# EAGLE design GameboyCartridgeKS_Ultima (EAGLE 9.5.2)
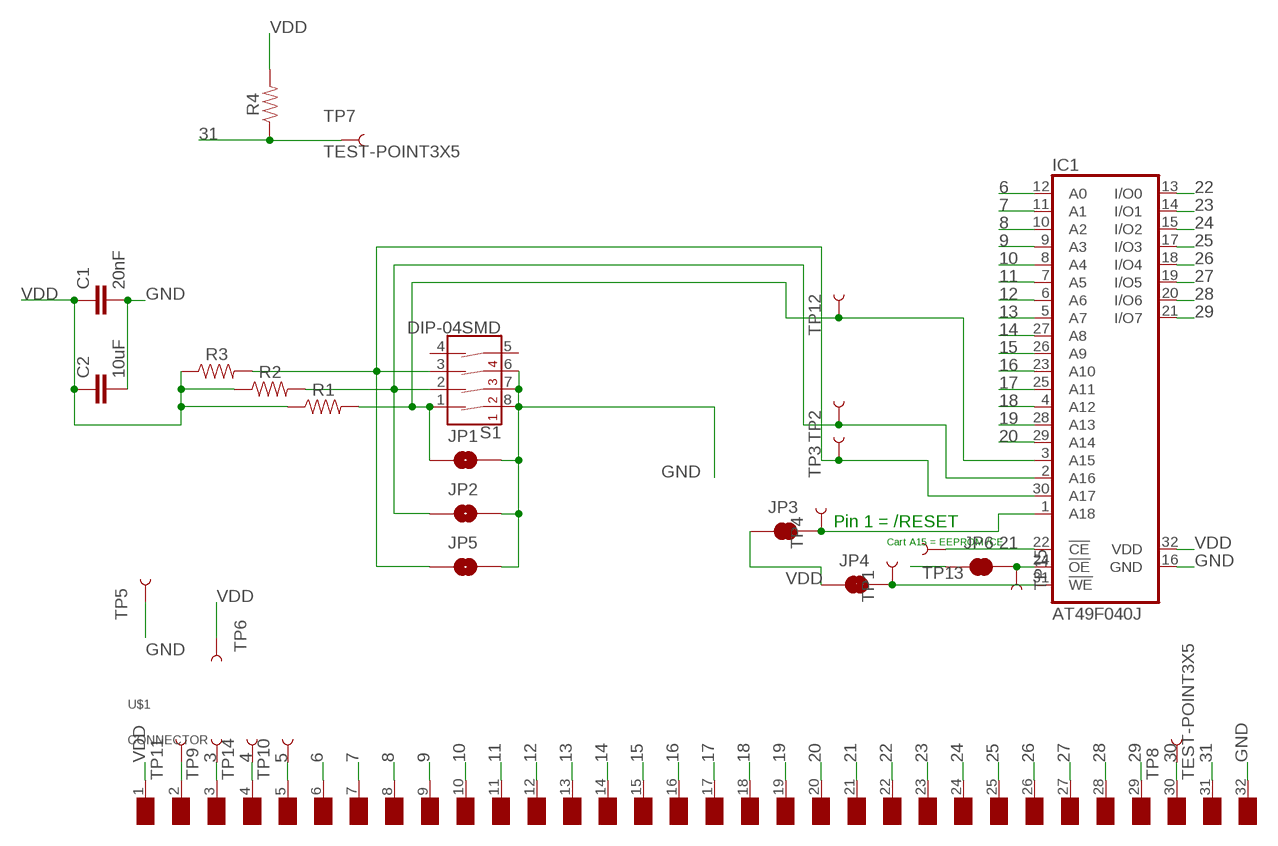
[diagram p0: schematic, sheet 1]

## Parts
C1  20nF  C-EUC0805  [C0805]
C2  10uF  10UF-1206-6.3V-20%  [1206]
IC1  AT49F040J  [PLCC32R]
JP1  JUMPER-SMT_2_NO_NO-SILK  [SMT-JUMPER_2_NO_NO-SILK]
JP2  JUMPER-SMT_2_NO_NO-SILK  [SMT-JUMPER_2_NO_NO-SILK]
JP3  JUMPER-SMT_2_NC_TRACE_SILK  [SMT-JUMPER_2_NC_TRACE_SILK]
JP4  JUMPER-SMT_2_NC_TRACE_SILK  [SMT-JUMPER_2_NC_TRACE_SILK]
JP5  JUMPER-SMT_2_NO_NO-SILK  [SMT-JUMPER_2_NO_NO-SILK]
JP6  JUMPER-SMT_2_NC_TRACE_SILK  [SMT-JUMPER_2_NC_TRACE_SILK]
R1  RESISTOR1206  [1206]
R2  RESISTOR1206  [1206]
R3  RESISTOR1206  [1206]
R4  RESISTOR1206  [1206]
S1  DIP-04SMD  [DIPSWITCH-04-SMD]
TP1  TEST-POINT3X5  [PAD.03X.05]
TP2  TEST-POINT3X5  [PAD.03X.05]
TP3  TEST-POINT3X5  [PAD.03X.05]
TP4  TEST-POINT3X5  [PAD.03X.05]
TP5  TEST-POINT3X5  [PAD.03X.05]
TP6  TEST-POINT3X5  [PAD.03X.05]
TP7  TEST-POINT3X5  [PAD.03X.05]
TP8  TEST-POINT3X5  [PAD.03X.05]
TP9  TEST-POINT3X5  [PAD.03X.05]
TP10  TEST-POINT3X5  [PAD.03X.05]
TP11  TEST-POINT3X5  [PAD.03X.05]
TP12  TEST-POINT3X5  [PAD.03X.05]
TP13  TEST-POINT3X5  [PAD.03X.05]
TP14  TEST-POINT3X5  [PAD.03X.05]
TP15  TEST-POINT3X5  [PAD.03X.05]
U$1  CONNECTOR  [CONNECTOR]

## Nets
3: TP9.P$1 U$1.3(/WR)
4: JP6.1 TP14.P$1 U$1.4(/RD)
5: TP10.P$1 U$1.5(/RCS)
6: IC1.12(A0) U$1.6(A0)
7: IC1.11(A1) U$1.7(A1)
8: IC1.10(A2) U$1.8(A2)
9: IC1.9(A3) U$1.9(A3)
10: IC1.8(A4) U$1.10(A4)
11: IC1.7(A5) U$1.11(A5)
12: IC1.6(A6) U$1.12(A6)
13: IC1.5(A7) U$1.13(A7)
14: IC1.27(A8) U$1.14(A8)
15: IC1.26(A9) U$1.15(A9)
16: IC1.23(A10) U$1.16(A10)
17: IC1.25(A11) U$1.17(A11)
18: IC1.4(A12) U$1.18(A12)
19: IC1.28(A13) U$1.19(A13)
20: IC1.29(A14) U$1.20(A14)
21: IC1.22(!CE) TP13.P$1 U$1.21(A15)
22: IC1.13(I/O0) U$1.22(D0)
23: IC1.14(I/O1) U$1.23(D1)
24: IC1.15(I/O2) U$1.24(D2)
25: IC1.17(I/O3) U$1.25(D3)
26: IC1.18(I/O4) U$1.26(D4)
27: IC1.19(I/O5) U$1.27(D5)
28: IC1.20(I/O6) U$1.28(D6)
29: IC1.21(I/O7) U$1.29(D7)
30: TP8.P$1 U$1.30(/RS)
31: R4.1 TP7.P$1 U$1.31(VIN)
GND: C1.2 C2.2 IC1.16(GND) JP1.2 JP2.2 JP5.2 S1.6(3B) S1.7(2B) S1.8(1B) TP5.P$1 U$1.32(GND)
N$1: IC1.31(!WE) JP4.2 TP1.P$1
N$2: TP11.P$1 U$1.2(NC)
N$3: IC1.24(!OE) JP6.2 TP15.P$1
N$4: IC1.3(A15) JP1.1 R1.2 S1.1(1A) TP12.P$1
N$7: IC1.1(A18) JP3.2 TP4.P$1
N$8: IC1.2(A16) JP2.1 R2.2 S1.2(2A) TP2.P$1
N$9: IC1.30(A17) JP5.1 R3.2 S1.3(3A) TP3.P$1
VDD: C1.1 C2.1 IC1.32(VDD) JP3.1 JP4.1 R1.1 R2.1 R3.1 R4.2 TP6.P$1 U$1.1(VDD)
Unconnected: S1.4(4A) S1.5(4B)

## Notes on the sheet
- Pin 1 = /RESET
- Cart A15 = EEPROM /CE

## Library data of the parts
C1 = resistor:C-EU: CAPACITOR, European symbol
C2 = SparkFun-Capacitors:10UF: 10.0µF ceramic capacitors A capacitor is a passive two-terminal electrical component used to store electrical energy temporarily in an electric field.; PROD_ID: CAP-10057
IC1 = gameboy:AT49F040J: 4-Megabit FLASH MEMORY (512 K x 8 bit) 5 V-only
JP1 JP2 JP5 = SparkFun-Jumpers:JUMPER-SMT_2_NO: Normally open jumper This jumper has two pads in close proximity to each other. Apply solder to close the connection. Round pads are easier to solder for beginners, but are a lot larger. SparkFun Product that uses the round pads: SparkFun EL Sequencer <https://www.sparkfun.com/products/12781>
JP3 JP4 JP6 = SparkFun-Jumpers:JUMPER-SMT_2_NC_TRACE: Normally closed trace jumper This jumper has a trace between two pads so it's normally closed (NC). Use a razor knife to open the connection. For best results follow the IPC guidelines for cutting traces: Cutout at least 0.063 mm (0.005 in). Remove all loose material to clean up the cut area. Seal the cut with an approved epoxy. Reapply solder to reclose the connection.
R1-R4 = SparkFun-Resistors:RESISTOR: Generic Resistor Package
S1 = SparkFun-Switches:DIP-04: 4-Position DIP Switch 4-circuit DIP (dual inline package) switch. Commonly used to physcially set a circuit's behavior. SparkFun Products Prototype Part; PROD_ID: SWCH-12418
TP1-TP15 = SparkFun-Connectors:TEST-POINT: SparkFun Test Points Bare copper test points for troubleshooting or In-Circuit-Testing. These are used by our Production team for verifying production board runs using pogo-pins on test beds. SparkFun Products: SparkFun LSM9DS1 Breakout <https://www.sparkfun.com/products/13284> SparkFun PSOC <https://www.sparkfun.com/products/13714> SparkFun Load Cell Amplifier <https://www.sparkfun.com/products/13879>
U$1 = gameboy:CONNECTOR: Connector Pads for Gameboy Cartridges

## Board
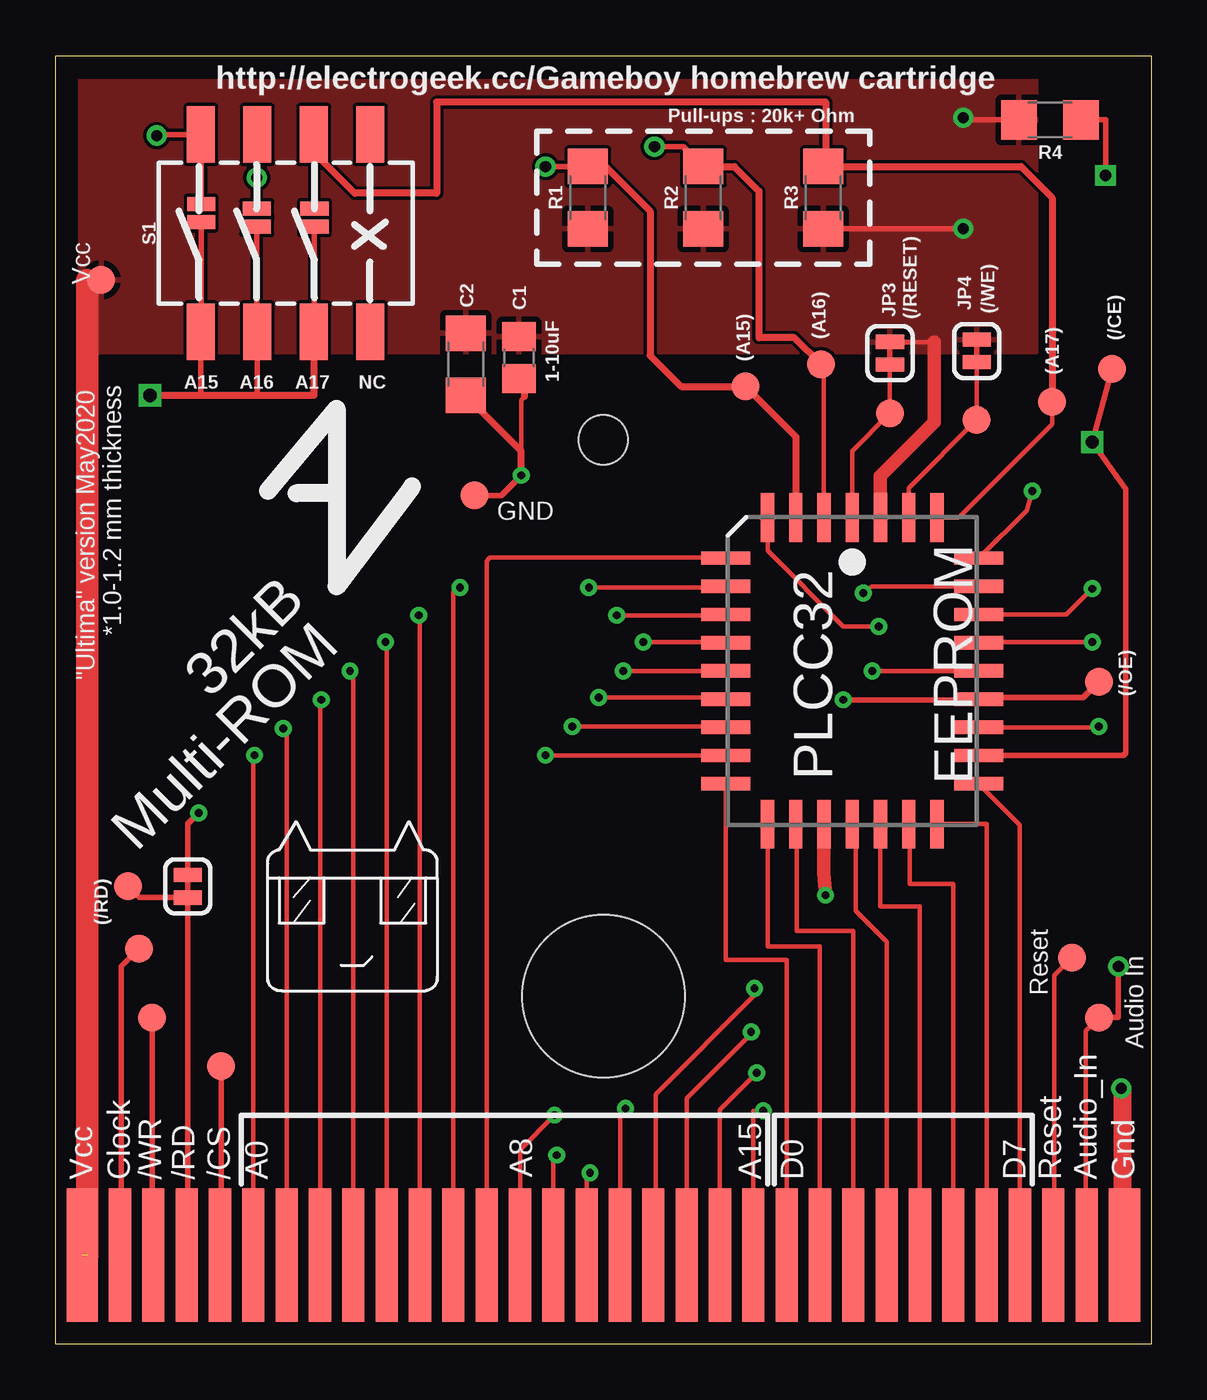
[diagram p1: board, top side]
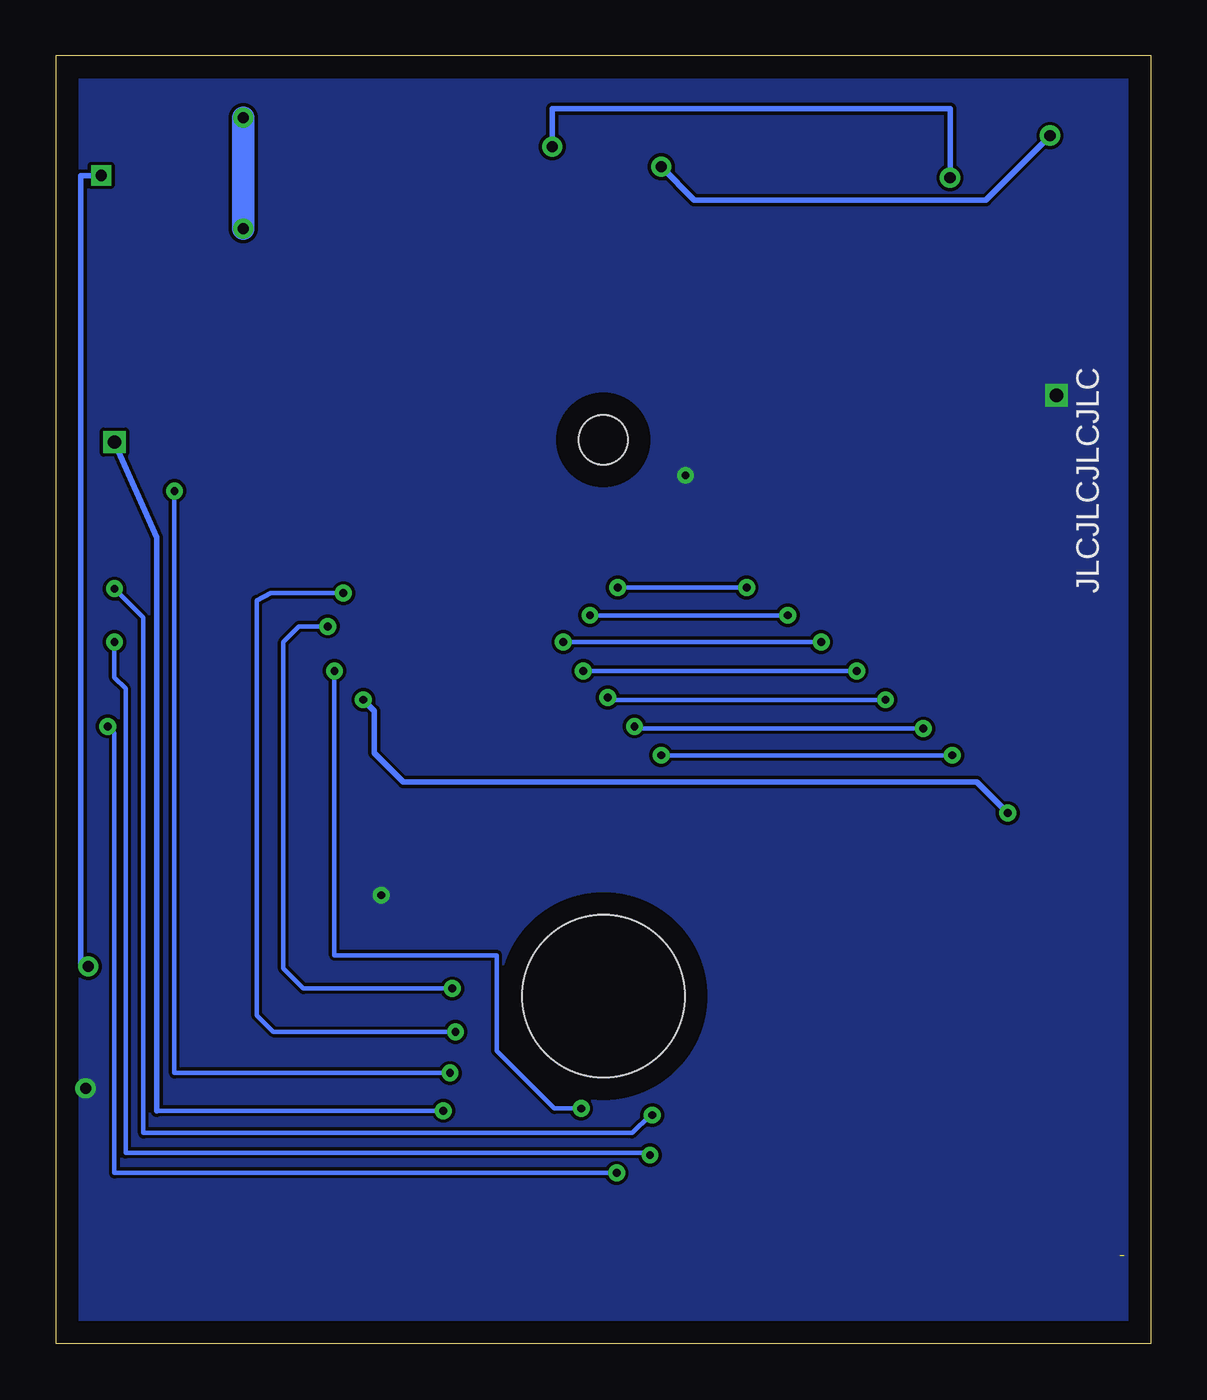
[diagram p2: board, bottom side, seen from below]

Size 49.3 x 58 mm. Coordinates in mm from the lower left corner, seen from the top.
Outline: 49.3,58 49.3,0 0,0 0,58 49.3,58
Copper layers (1*16): Top 0.035mm / dielectric 1.5mm / Bottom 0.035mm
Design rules "default": minimum track width 6mil, minimum drill 0.35mm, track to track 6mil, track to pad 6mil, pad to pad 6mil, via to via 6mil, smd to smd 6mil, copper to edge 40mil, drill to drill 6mil, minimum pad ring 10mil, minimum via ring 8mil, stop-mask expansion 4mil, vias tented up to drill 0mil, thermal gap 10mil
Holes 7.3 mm at 24.65,15.65
Holes 2.2 mm at 24.65,40.7

### Footprints (pad centres in the part's own frame; a part is rotated, then mirrored left to right if it is on the bottom)
C0805 = smd 1.3 x 1.5: 1 -0.95,0; 2 0.95,0
1206 = smd 1.6 x 1.8: 1 -1.4,0; 2 1.4,0
PLCC32R = smd 0.6 x 2.2: 1 0,6.9; 2 -1.27,6.9; 3 -2.54,6.9; 4 -3.81,6.9; 14 -3.81,-6.9; 15 -2.54,-6.9; 16 -1.27,-6.9; 17 0,-6.9; 18 1.27,-6.9; 19 2.54,-6.9; 20 3.81,-6.9; 30 3.81,6.9; 31 2.54,6.9; 32 1.27,6.9 | smd 2.2 x 0.6: 5 -5.7,5.08; 6 -5.7,3.81; 7 -5.7,2.54; 8 -5.7,1.27; 9 -5.7,0; 10 -5.7,-1.27; 11 -5.7,-2.54; 12 -5.7,-3.81; 13 -5.7,-5.08; 21 5.7,-5.08; 22 5.7,-3.81; 23 5.7,-2.54; 24 5.7,-1.27; 25 5.7,0; 26 5.7,1.27; 27 5.7,2.54; 28 5.7,3.81; 29 5.7,5.08
SMT-JUMPER_2_NO_NO-SILK = smd 0.635 x 1.27: 1 -0.406,0; 2 0.406,0
SMT-JUMPER_2_NC_TRACE_SILK = smd 0.635 x 1.27: 1 -0.508,0; 2 0.508,0
DIPSWITCH-04-SMD = smd 1.27 x 2.54: 1 -3.81,4.445; 2 -1.27,4.445; 3 1.27,4.445; 4 3.81,4.445; 5 3.81,-4.445; 6 1.27,-4.445; 7 -1.27,-4.445; 8 -3.81,-4.445
PAD.03X.05 = smd 1.27 x 1.27: P$1 0,0
CONNECTOR = smd 1.4 x 6: 1 0.7,-3; 32 47.6,-3 | smd 1 x 6: 2 2.4,-3; 3 3.9,-3; 4 5.4,-3; 5 6.9,-3; 6 8.4,-3; 7 9.9,-3; 8 11.4,-3; 9 12.9,-3; 10 14.4,-3; 11 15.9,-3; 12 17.4,-3; 13 18.9,-3; 14 20.4,-3; 15 21.9,-3; 16 23.4,-3; 17 24.9,-3; 18 26.4,-3; 19 27.9,-3; 20 29.4,-3; 21 30.9,-3; 22 32.4,-3; 23 33.9,-3; 24 35.4,-3; 25 36.9,-3; 26 38.4,-3; 27 39.9,-3; 28 41.4,-3; 29 42.9,-3; 30 44.4,-3; 31 45.9,-3

### Placement (x,y rotation side)
C1  20.85,44.4 270 top
C2  18.45,44.1 270 top
IC1  35.85,30.3 0 top
JP1  6.55,50.9 270 top
JP2  9.05,50.7 270 top
JP3  37.55,44.6 270 top
JP4  41.45,44.7 270 top
JP5  11.65,50.7 270 top
JP6  5.95,20.6 90 top
R1  23.95,51.6 90 top
R2  29.15,51.6 90 top
R3  34.55,51.6 90 top
R4  44.75,55.1 180 top
S1  10.35,50 0 top
TP1  41.45,41.6 270 top
TP2  34.45,44.1 0 top
TP3  44.85,42.4 0 top
TP4  37.55,41.9 270 top
TP5  18.85,38.2 0 top
TP6  2.05,47.9 0 top
TP7  46.95,14.7 0 top
TP8  45.75,17.4 0 top
TP9  4.35,14.7 0 top
TP10  7.45,12.5 0 top
TP11  3.75,17.8 0 top
TP12  31.05,43.1 0 top
TP13  47.55,43.9 0 top
TP14  3.25,20.6 0 top
TP15  46.95,29.8 0 top
U$1  0.5,7 0 top
U$2  [GAMEBOY_LOGO]  20.35,21 0 top
U$3  [PIGMAN1]  9.55,15.9 0 top

### Tracks (layer width: path | path; a pad name or v marks a point on that pad's centre or on a via)
3
  Top 0.254: TP9.P$1 4.35,4.05 U$1.3
4
  Top 0.2: 5.95,4.05 U$1.4
  Top 0.254: 5.95,4.05 JP6.1 3.76,20.09 TP14.P$1
5
  Top 0.254: TP10.P$1 7.45,4.05 U$1.5
6  (via drill 0.35)
  Top 0.2: U$1.6 8.9,26.45 v8.95,26.5 | v22.05,26.5 IC1.12
  Bottom 0.2: v8.95,26.5 v22.05,26.5
7  (via drill 0.35)
  Top 0.2: U$1.7 10.4,27.55 v10.25,27.7 | v23.25,27.8 30.11,27.8 IC1.11
  Bottom 0.2: v10.25,27.7 23.15,27.7 v23.25,27.8
8  (via drill 0.35)
  Top 0.152: U$1.8 11.97,4.07
  Top 0.2: U$1.8 11.9,28.95 v11.95,29 | v24.45,29.1 30.08,29.1 IC1.10
  Bottom 0.2: v11.95,29 24.35,29 v24.45,29.1
9  (via drill 0.35)
  Top 0.2: U$1.9 13.4,30.15 v13.25,30.3 | v25.55,30.3 IC1.9
  Bottom 0.2: v13.25,30.3 v25.55,30.3
10  (via drill 0.35)
  Top 0.2: U$1.10 14.9,31.55 v14.85,31.6 | IC1.8 30.12,31.6 v26.45,31.6
  Bottom 0.2: v14.85,31.6 v26.45,31.6
11  (via drill 0.35)
  Top 0.2: U$1.11 16.4,32.75 v16.35,32.8 | IC1.7 30.11,32.8 v25.25,32.8
  Bottom 0.2: v16.35,32.8 v25.25,32.8
12  (via drill 0.35)
  Top 0.2: U$1.12 17.9,33.85 18.15,34.1 v18.2,34.05 | v24,34.05 30.09,34.05 IC1.6
  Bottom 0.2: v18.2,34.05 v24,34.05
13
  Top 0.152: U$1.13 19.25,4.15
  Top 0.2: U$1.13 19.4,35.25 19.55,35.4 30.13,35.4 IC1.5
14  (via drill 0.35)
  Top 0.2: U$1.14 20.9,8.75 v22.45,10.3 | v46.65,34 45.49,32.84 IC1.27
  Bottom 0.2: v22.45,10.3 22.55,10.3 23.35,9.5 45.35,9.5 45.35,32.7 v46.65,34
15  (via drill 0.35)
  Top 0.2: U$1.15 22.4,8.35 v22.55,8.5 | IC1.26 41.58,31.6 v46.65,31.6
  Bottom 0.2: v22.55,8.5 22.65,8.6 46.15,8.6 46.15,29.5 46.65,30 v46.65,31.6
16  (via drill 0.35)
  Top 0.2: U$1.16 23.9,7.55 v24.05,7.7 | v46.95,27.8 46.91,27.76 IC1.23
  Bottom 0.2: v24.05,7.7 46.65,7.7 46.65,27.5 v46.95,27.8
17  (via drill 0.35)
  Top 0.2: U$1.17 25.4,10.35 v25.65,10.6 | IC1.25 v36.75,30.3
  Bottom 0.2: v25.65,10.6 26.85,10.6 29.45,13.2 29.45,17.5 36.75,17.5 v36.75,30.3
18  (via drill 0.35)
  Top 0.2: U$1.18 27,4.1 27,11.24 31.45,15.69 v31.45,16 | v37.05,32.3 35.45,32.3 32.04,35.71 IC1.4
  Bottom 0.2: v31.45,16 38.15,16 39.05,16.9 39.05,31.6 38.35,32.3 v37.05,32.3
19  (via drill 0.35)
  Top 0.152: U$1.19 28.35,4.05
  Top 0.2: U$1.19 28.4,11.05 31.3,13.95 v31.3,14.05 | IC1.28 36.73,34.1 v36.35,33.8
  Bottom 0.2: v31.3,14.05 39.5,14.05 40.25,14.8 40.25,33.47 39.61,33.8 v36.35,33.8
20  (via drill 0.35)
  Top 0.2: U$1.20 29.9,10.55 v31.55,12.2 | IC1.29 43.7,37.52 v43.95,38.4
  Bottom 0.2: v43.95,38.4 43.95,12.2 v31.55,12.2
21  (via drill 0.35, 0.6)
  Top 0.2: U$1.21 31.4,10.5 v31.85,10.5
  Top 0.254: IC1.22 48.04,26.49 48.16,26.61 48.16,38.49 v46.65,40.6 TP13.P$1
  Bottom 0.2: v31.85,10.5 44.75,10.5
  Bottom 0.254: v46.65,40.6 44.75,36.3 44.75,10.5
22
  Top 0.2: U$1.22 32.9,17.3 30.15,17.3 IC1.13
23
  Top 0.2: U$1.23 34.4,17.9 32.04,17.9 IC1.14
24
  Top 0.152: 35.95,4.05 U$1.24
  Top 0.2: U$1.24 35.9,18.6 33.35,18.6 33.35,23.4 IC1.15
25
  Top 0.152: 37.25,4.15 U$1.25
  Top 0.2: U$1.25 37.4,18.1 36,19.5 36,23.25 IC1.17
26
  Top 0.2: U$1.26 38.9,19.7 37.12,19.7 IC1.18
27
  Top 0.2: U$1.27 40.4,20.7 38.45,20.7 38.45,23.4 IC1.19
28
  Top 0.152: 41.83,4 U$1.28
  Top 0.2: U$1.28 41.9,23.4 IC1.20
29
  Top 0.2: IC1.21 | IC1.21 43.4,23.37 U$1.29 | U$1.29
30
  Top 0.152: U$1.30 45.1,4.2
  Top 0.2: TP8.P$1 44.95,16.6 44.95,4.05 U$1.30
31  (via drill 0.5)
  Top 0.152: U$1.31 46.45,4.05
  Top 0.2: TP7.P$1 46.35,14.1 46.35,4.05 U$1.31
  Top 0.254: TP7.P$1 47.15,14.7 47.35,14.7 47.83,14.7 v47.83,17 | R4.1 47.25,55.1 v47.25,52.6
  Bottom 0.254: v47.25,52.6 48.16,52.6 48.16,17 v47.83,17
GND  (via drill 0.35, 0.5, 0.6)
  Top 0.152: U$1.32 48.15,4.05
  Top 0.2: v47.95,11.5 48,11.45 | U$1.32 48,4.1 | v20.95,39.1 20.95,42.5 21.1,42.65
  Top 0.254: 18.85,37.7 TP5.P$1 20.05,38.2 v20.95,39.1 | 6.55,50.29 JP1.2 S1.8 6.54,42.7 v4.25,42.7 9.08,42.7 S1.7 9.05,45.55 JP2.2 | JP5.2 11.65,45.55 11.45,45.55
  Top 0.305: C1.2 21.1,43.2 21.1,42.65 | v20.95,39.1 20.95,40.2 C2.2 | 11.45,45.55 S1.6 11.62,42.7 v4.25,42.7
  Top 0.61: v34.65,20.2 34.58,21.17 IC1.16
  Top 0.813: 48,11.45 48,4.1
  Bottom 0.2: v47.95,11.5 47.85,11.6
  pour Bottom: 0.15,56.9 49.05,56.9 49.05,0.1 0.15,0.1
N$1
  Top 0.2: JP4.2 TP1.P$1 38.39,38.54 IC1.31
N$2
  Top 0.254: TP11.P$1 2.95,17 2.95,4.05 U$1.2
N$3  (via drill 0.35)
  Top 0.254: JP6.2 5.95,23.4 v6.45,23.9 | v35.45,29 41.52,29 IC1.24 41.62,29.1 46.25,29.1 TP15.P$1
  Bottom 0.254: v6.45,23.9 7.85,25.3 33.65,25.3 34.95,26.6 34.95,28.5 v35.45,29
N$4  (via drill 0.5)
  Top 0.254: JP1.1 S1.1 4.55,54.45 v4.55,54.4 | v22.05,53 R1.2
  Top 0.305: IC1.3 33.31,40.84 TP12.P$1 28.15,43.1 26.75,44.5 26.75,51 24.75,53 R1.2
  Bottom 0.254: v4.55,54.4 7.45,51.5 20.55,51.5 v22.05,53
N$7
  Top 0.2: JP3.2 TP4.P$1 35.85,40.2 IC1.1
N$8  (via drill 0.5)
  Top 0.2: IC1.2 34.58,43.97 TP2.P$1 34.34,44.1
  Top 0.254: JP2.1 9.05,54.45 | 9.05,54.45 S1.2 | 9.05,54.45 9.05,54.41 v9.05,52.5 | R2.2 28.25,53.9 v26.95,53.9
  Top 0.305: R2.2 30.55,53 31.65,51.9 31.65,45.3 33.25,45.3 TP2.P$1
  Bottom 0.254: v9.05,52.5 9.05,55.6 26.95,55.6 v26.95,53.9
N$9
  Top 0.2: IC1.30 40.65,37.2 44.85,41.4 44.85,42.3 TP3.P$1
  Top 0.254: JP5.1 11.65,54.45 S1.3
  Top 0.305: S1.3 11.62,53.65 13.46,51.8 17.15,51.8 17.15,55.9 34.65,55.9 34.65,53.1 R3.2 43.45,53 44.85,51.6 44.85,42.3
VDD  (via drill 0.5)  (1 unrouted)
  Top 0.2: JP4.1 41.35,45.11 | 36.94,37.38 IC1.32 | 39.44,45.11 JP3.1 39.55,45.11
  Top 0.254: R4.2 40.55,55.1 40.55,55.2 v40.85,55.2 | v40.85,50.2 R3.1 | 18.45,45.7 C2.1
  Top 0.61: IC1.32 37.12,39.07 39.55,41.5 39.55,45.11
  Top 0.813: TP6.P$1 1.42,47.9
  Top 1.016: 1.42,47.9 1.42,4
  Bottom 1.016: v40.85,55.2 v40.85,50.2
  pour Top: 0.15,8.2 0.15,57.1 44.15,57.1 44.15,44.6 1.85,44.6 1.85,8.2

### Text on the board
tPlace: http://electrogeek.cc/Gameboy homebrew cartridge | Pull-ups : 20k+ Ohm | Vcc | (/RESET) | (/WE) | (A16) | (/CE) | 1-10uF | (A15) | (A17) | A15 | A16 | A17 | NC | GND | *1.0-1.2 mm thickness | "Ultima" version May2020 | (/OE) | 32kB | Multi-ROM | (/RD) | Reset | Audio In | A8 | Vcc | Clock | /WR | /RD | /CS | A0 | A15 | D0 | D7 | Reset | Audio_In | Gnd
bPlace: JLCJLCJLCJLC
tNames: PLCC32 | EEPROM